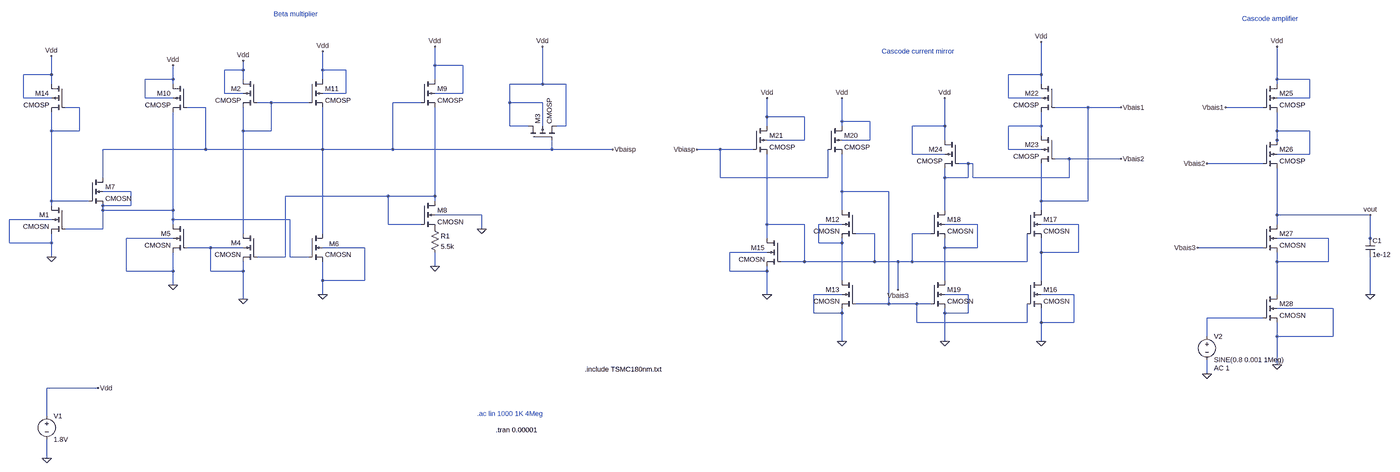
[diagram p0: schematic 180nm_Circuit.asc, whole sheet]
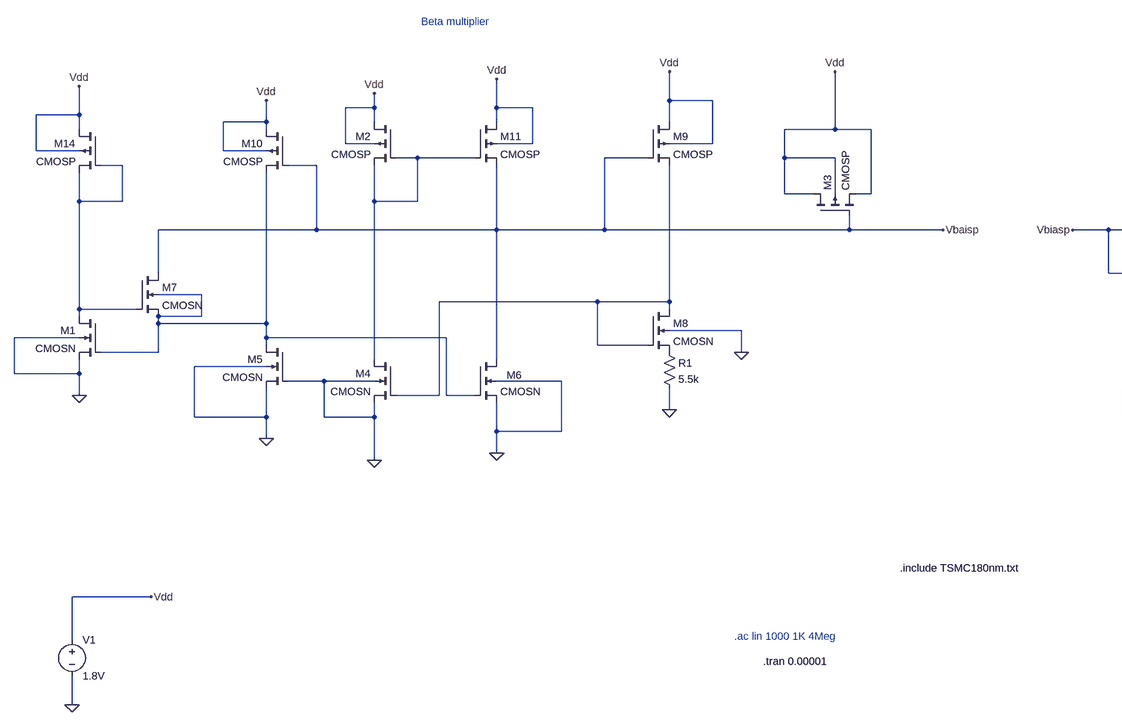
[diagram p1: schematic 180nm_Circuit.asc, part, row 1 of 1, column 1 of 2]
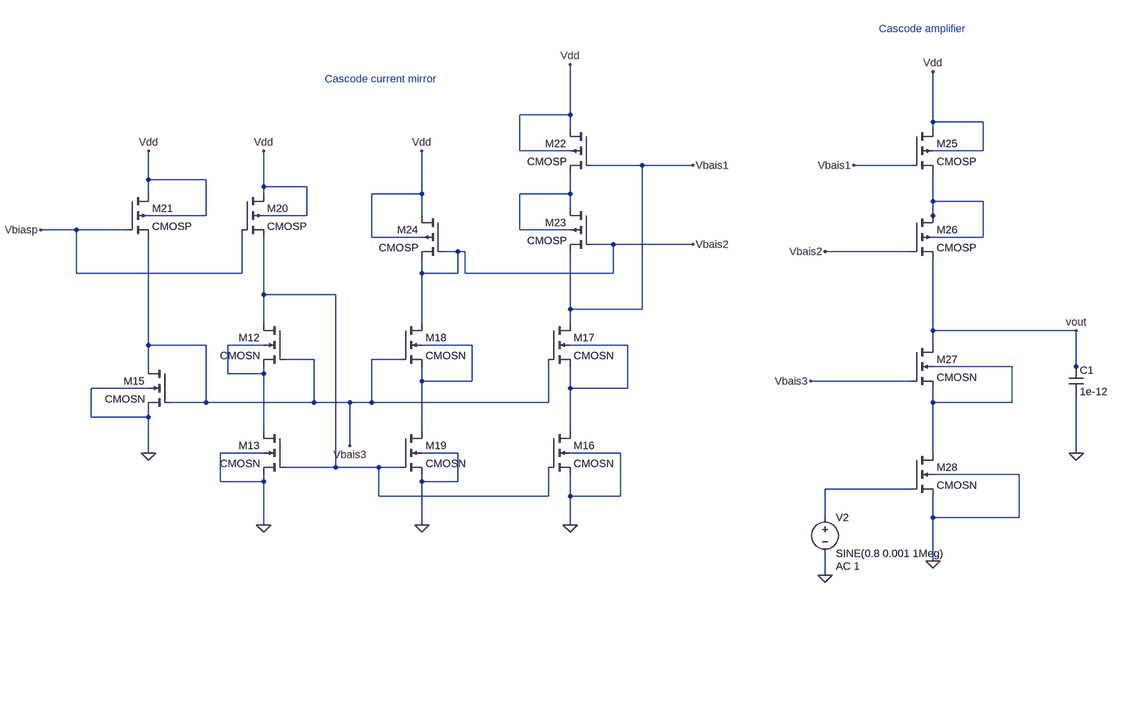
[diagram p2: schematic 180nm_Circuit.asc, part, row 1 of 1, column 2 of 2]
180nm_Circuit.asc, the LTspice schematic file:
Version 4
SHEET 1 6480 1124
WIRE 1392 -416 1392 -480
WIRE 1488 -416 1392 -416
WIRE 736 -400 736 -432
WIRE 736 -400 672 -400
WIRE 1008 -400 1008 -464
WIRE 1088 -400 1008 -400
WIRE 80 -384 80 -448
WIRE 80 -384 -16 -384
WIRE 3504 -384 3504 -496
WIRE 3504 -384 3392 -384
WIRE 496 -368 496 -416
WIRE 496 -368 400 -368
WIRE 736 -368 736 -400
WIRE 1008 -368 1008 -400
WIRE 1392 -368 1392 -416
WIRE 4736 -368 4736 -480
WIRE 4848 -368 4736 -368
WIRE 80 -352 80 -384
WIRE 496 -352 496 -368
WIRE 1760 -352 1760 -480
WIRE 1760 -352 1648 -352
WIRE 1840 -352 1760 -352
WIRE 3504 -352 3504 -384
WIRE 4736 -352 4736 -368
WIRE 672 -320 672 -400
WIRE 736 -320 672 -320
WIRE 1088 -320 1088 -400
WIRE 1088 -320 1008 -320
WIRE 1488 -320 1488 -416
WIRE 1488 -320 1392 -320
WIRE -16 -304 -16 -384
WIRE 80 -304 -16 -304
WIRE 400 -304 400 -368
WIRE 496 -304 400 -304
WIRE 3392 -304 3392 -384
WIRE 3504 -304 3392 -304
WIRE 4848 -304 4848 -368
WIRE 4848 -304 4736 -304
WIRE 832 -288 784 -288
WIRE 960 -288 832 -288
WIRE 1344 -288 1248 -288
WIRE 1648 -288 1648 -352
WIRE 1760 -288 1648 -288
WIRE 176 -272 128 -272
WIRE 608 -272 544 -272
WIRE 3664 -272 3552 -272
WIRE 4064 -272 3664 -272
WIRE 4688 -272 4560 -272
WIRE 2528 -240 2528 -304
WIRE 2656 -240 2528 -240
WIRE 2784 -224 2784 -304
WIRE 2880 -224 2784 -224
WIRE 1648 -208 1648 -288
WIRE 1712 -208 1648 -208
WIRE 1760 -208 1760 -288
WIRE 1840 -208 1840 -352
WIRE 1840 -208 1808 -208
WIRE 2528 -208 2528 -240
WIRE 2784 -208 2784 -224
WIRE 3136 -208 3136 -304
WIRE 3136 -208 3024 -208
WIRE 3504 -208 3504 -256
WIRE 3504 -208 3392 -208
WIRE 80 -192 80 -256
WIRE 176 -192 176 -272
WIRE 176 -192 80 -192
WIRE 736 -192 736 -272
WIRE 832 -192 832 -288
WIRE 832 -192 736 -192
WIRE 4736 -192 4736 -256
WIRE 4848 -192 4736 -192
WIRE 3504 -176 3504 -208
WIRE 2656 -160 2656 -240
WIRE 2656 -160 2528 -160
WIRE 2880 -160 2880 -224
WIRE 2880 -160 2784 -160
WIRE 3136 -160 3136 -208
WIRE 4736 -160 4736 -192
WIRE 4736 -144 4736 -160
WIRE 608 -128 608 -272
WIRE 608 -128 256 -128
WIRE 1008 -128 1008 -272
WIRE 1008 -128 608 -128
WIRE 1248 -128 1248 -288
WIRE 1248 -128 1008 -128
WIRE 1792 -128 1792 -160
WIRE 1792 -128 1248 -128
WIRE 2000 -128 1792 -128
WIRE 2368 -128 2288 -128
WIRE 2480 -128 2368 -128
WIRE 3392 -128 3392 -208
WIRE 3504 -128 3392 -128
WIRE 3024 -112 3024 -208
WIRE 3136 -112 3024 -112
WIRE 4848 -112 4848 -192
WIRE 4848 -112 4736 -112
WIRE 3600 -96 3552 -96
WIRE 4064 -96 3600 -96
WIRE 3216 -80 3184 -80
WIRE 3232 -80 3216 -80
WIRE 4688 -80 4496 -80
WIRE 256 -32 256 -128
WIRE 2368 -32 2368 -128
WIRE 2736 -32 2736 -128
WIRE 2736 -32 2368 -32
WIRE 3136 -32 3136 -64
WIRE 3216 -32 3216 -80
WIRE 3216 -32 3136 -32
WIRE 3232 -32 3232 -80
WIRE 3600 -32 3600 -96
WIRE 3600 -32 3232 -32
WIRE 352 16 256 16
WIRE 2784 16 2784 -112
WIRE 2944 16 2784 16
WIRE 1232 32 880 32
WIRE 1392 32 1392 -272
WIRE 1392 32 1232 32
WIRE 80 48 80 -192
WIRE 208 48 80 48
WIRE 1392 48 1392 32
WIRE 3504 48 3504 -80
WIRE 3664 48 3664 -272
WIRE 3664 48 3504 48
WIRE 80 64 80 48
WIRE 352 64 352 16
WIRE 352 64 256 64
WIRE 256 80 256 64
WIRE 496 80 496 -256
WIRE 496 80 256 80
WIRE 2784 80 2784 16
WIRE 3136 80 3136 -32
WIRE 3504 80 3504 48
WIRE 1552 96 1392 96
WIRE 4736 96 4736 -64
WIRE 5088 96 4736 96
WIRE 80 112 -64 112
WIRE 496 112 496 80
WIRE 896 112 496 112
WIRE 496 128 496 112
WIRE 1232 128 1232 32
WIRE 1344 128 1232 128
WIRE 2528 128 2528 -112
WIRE 2656 128 2528 128
WIRE 2784 128 2704 128
WIRE 3248 128 3136 128
WIRE 3632 128 3504 128
WIRE 4736 128 4736 96
WIRE 256 144 256 80
WIRE 256 144 128 144
WIRE 1552 144 1552 96
WIRE 736 160 736 -192
WIRE 1008 160 1008 -128
WIRE 2896 160 2832 160
WIRE 3088 160 3024 160
WIRE 496 176 336 176
WIRE 2528 176 2528 128
WIRE 4912 176 4736 176
WIRE 5088 176 5088 96
WIRE -64 192 -64 112
WIRE 80 192 80 160
WIRE 80 192 -64 192
WIRE 2704 192 2704 128
WIRE 2784 192 2784 176
WIRE 2784 192 2704 192
WIRE 5088 192 5088 176
WIRE 624 208 544 208
WIRE 736 208 624 208
WIRE 1152 208 1008 208
WIRE 3136 208 3136 176
WIRE 3248 208 3248 128
WIRE 3248 208 3136 208
WIRE 4688 208 4464 208
WIRE 2528 224 2400 224
WIRE 3504 224 3504 176
WIRE 3632 224 3632 128
WIRE 3632 224 3504 224
WIRE 80 240 80 192
WIRE 880 240 880 32
WIRE 880 240 784 240
WIRE 896 240 896 112
WIRE 960 240 896 240
WIRE 2656 256 2656 128
WIRE 2656 256 2576 256
WIRE 2896 256 2896 160
WIRE 2896 256 2656 256
WIRE 2976 256 2896 256
WIRE 3024 256 3024 160
WIRE 3024 256 2976 256
WIRE 3456 256 3456 160
WIRE 3456 256 3024 256
WIRE 4736 256 4736 224
WIRE 4912 256 4912 176
WIRE 4912 256 4736 256
WIRE 1392 272 1392 224
WIRE 336 288 336 176
WIRE 496 288 496 224
WIRE 496 288 336 288
WIRE 624 288 624 208
WIRE 736 288 736 256
WIRE 736 288 624 288
WIRE 2400 288 2400 224
WIRE 2528 288 2528 272
WIRE 2528 288 2400 288
WIRE 1008 320 1008 256
WIRE 1152 320 1152 208
WIRE 1152 320 1008 320
WIRE 2784 320 2784 192
WIRE 3136 320 3136 208
WIRE 3504 320 3504 224
WIRE 496 336 496 288
WIRE 2976 352 2976 256
WIRE 1008 368 1008 320
WIRE 2528 368 2528 288
WIRE 2784 368 2688 368
WIRE 3216 368 3136 368
WIRE 3616 368 3504 368
WIRE 4736 368 4736 256
WIRE 5088 368 5088 240
WIRE 736 384 736 288
WIRE 2944 400 2944 16
WIRE 2944 400 2832 400
WIRE 3040 400 2944 400
WIRE 3088 400 3040 400
WIRE 4928 416 4736 416
WIRE 2688 432 2688 368
WIRE 2784 432 2784 416
WIRE 2784 432 2688 432
WIRE 3136 432 3136 416
WIRE 3216 432 3216 368
WIRE 3216 432 3136 432
WIRE 4688 448 4496 448
WIRE 3040 464 3040 400
WIRE 3456 464 3456 400
WIRE 3456 464 3040 464
WIRE 3504 464 3504 416
WIRE 3616 464 3616 368
WIRE 3616 464 3504 464
WIRE 4496 512 4496 448
WIRE 4736 512 4736 464
WIRE 4928 512 4928 416
WIRE 4928 512 4736 512
WIRE 2784 528 2784 432
WIRE 3136 528 3136 432
WIRE 3504 528 3504 464
WIRE 4736 608 4736 512
WIRE 4496 640 4496 592
WIRE 240 688 64 688
WIRE 64 784 64 688
WIRE 64 928 64 864
FLAG 496 336 0
FLAG 736 384 0
FLAG 1008 368 0
FLAG 80 240 0
FLAG 1392 272 0
FLAG 64 928 0
FLAG 240 688 Vdd
FLAG 80 -448 Vdd
FLAG 496 -416 Vdd
FLAG 736 -432 Vdd
FLAG 1008 -464 Vdd
FLAG 1392 -480 Vdd
FLAG 1760 -480 Vdd
FLAG 2528 368 0
FLAG 2784 528 0
FLAG 3136 528 0
FLAG 3504 528 0
FLAG 2528 -304 Vdd
FLAG 2784 -304 Vdd
FLAG 3136 -304 Vdd
FLAG 3504 -496 Vdd
FLAG 5088 368 0
FLAG 4736 608 0
FLAG 4064 -272 Vbais1
FLAG 4064 -96 Vbais2
FLAG 4560 -272 Vbais1
FLAG 4496 -80 Vbais2
FLAG 4736 -480 Vdd
FLAG 4496 640 0
FLAG 2976 352 Vbais3
FLAG 4464 208 Vbais3
FLAG 2000 -128 Vbaisp
FLAG 2288 -128 Vbiasp
FLAG 1552 144 0
FLAG 5088 96 vout
SYMBOL nmos4 784 160 M0
SYMATTR InstName M4
SYMATTR Value2 l=180nm w=900nm
SYMATTR Value CMOSN
SYMBOL nmos4 544 128 M0
SYMATTR InstName M5
SYMATTR Value2 l=180nm w=900nm
SYMATTR Value CMOSN
SYMBOL nmos4 960 160 R0
WINDOW 0 70 35 Left 2
SYMATTR InstName M6
SYMATTR Value2 l=180nm w=900nm
SYMATTR Value CMOSN
SYMBOL nmos4 208 -32 R0
SYMATTR InstName M7
SYMATTR Value2 l=180nm w=360nm
SYMATTR Value CMOSN
SYMBOL nmos4 1344 48 R0
SYMATTR InstName M8
SYMATTR Value2 l=180nm w=2700nm
SYMATTR Value CMOSN
SYMBOL pmos4 1344 -368 R0
SYMATTR InstName M9
SYMATTR Value2 l=180nm w=2160nm
SYMATTR Value CMOSP
SYMBOL pmos4 544 -352 M0
SYMATTR InstName M10
SYMATTR Value2 l=180nm w=2160nm
SYMATTR Value CMOSP
SYMBOL pmos4 128 -352 M0
SYMATTR InstName M14
SYMATTR Value2 l=360nm w=180nm
SYMATTR Value CMOSP
SYMBOL pmos4 1712 -160 R270
SYMATTR InstName M3
SYMATTR Value2 l=180n w=180n
SYMATTR Value CMOSP
SYMBOL res 1376 128 R0
SYMATTR InstName R1
SYMATTR Value 5.5k
SYMBOL voltage 64 768 R0
WINDOW 123 0 0 Left 0
WINDOW 39 0 0 Left 0
SYMATTR InstName V1
SYMATTR Value 1.8V
SYMBOL nmos4 128 64 M0
SYMATTR InstName M1
SYMATTR Value2 l=180nm w=900nm
SYMATTR Value CMOSN
SYMBOL pmos4 784 -368 M0
SYMATTR InstName M2
SYMATTR Value2 l=180nm w=2160nm
SYMATTR Value CMOSP
SYMBOL pmos4 960 -368 R0
SYMATTR InstName M11
SYMATTR Value2 l=180nm w=2160nm
SYMATTR Value CMOSP
SYMBOL nmos4 2832 80 M0
SYMATTR InstName M12
SYMATTR Value2 l=360nm w=360nm
SYMATTR Value CMOSN
SYMBOL nmos4 2832 320 M0
SYMATTR InstName M13
SYMATTR Value2 l=180nm w=540nm
SYMATTR Value CMOSN
SYMBOL nmos4 2576 176 M0
SYMATTR InstName M15
SYMATTR Value2 l=360nm w=360nm
SYMATTR Value CMOSN
SYMBOL nmos4 3456 320 R0
SYMATTR InstName M16
SYMATTR Value2 l=360nm w=360nm
SYMATTR Value CMOSN
SYMBOL nmos4 3456 80 R0
SYMATTR InstName M17
SYMATTR Value2 l=180nm w=360nm
SYMATTR Value CMOSN
SYMBOL nmos4 3088 80 R0
SYMATTR InstName M18
SYMATTR Value2 l=360nm w=360nm
SYMATTR Value CMOSN
SYMBOL nmos4 3088 320 R0
SYMATTR InstName M19
SYMATTR Value2 l=360nm w=360nm
SYMATTR Value CMOSN
SYMBOL pmos4 2736 -208 R0
SYMATTR InstName M20
SYMATTR Value2 l=180nm w=2700nm
SYMATTR Value CMOSP
SYMBOL pmos4 2480 -208 R0
SYMATTR InstName M21
SYMATTR Value2 l=180nm w=2700nm
SYMATTR Value CMOSP
SYMBOL pmos4 3552 -352 M0
SYMATTR InstName M22
SYMATTR Value2 l=180nm w=2700nm
SYMATTR Value CMOSP
SYMBOL pmos4 3552 -176 M0
SYMATTR InstName M23
SYMATTR Value2 l=180nm w=2700nm
SYMATTR Value CMOSP
SYMBOL pmos4 3184 -160 M0
SYMATTR InstName M24
SYMATTR Value2 l=360nm w=2160nm
SYMATTR Value CMOSP
SYMBOL pmos4 4688 -352 R0
SYMATTR InstName M25
SYMATTR Value2 l=180nm w=2160nm
SYMATTR Value CMOSP
SYMBOL pmos4 4688 -160 R0
SYMATTR InstName M26
SYMATTR Value2 l=180nm w=2160nm
SYMATTR Value CMOSP
SYMBOL nmos4 4688 128 R0
SYMATTR InstName M27
SYMATTR Value2 l=180nm w=900nm
SYMATTR Value CMOSN
SYMBOL nmos4 4688 368 R0
SYMATTR InstName M28
SYMATTR Value2 l=180nm w=900nm
SYMATTR Value CMOSN
SYMBOL cap 5072 176 R0
SYMATTR InstName C1
SYMATTR Value 1e-12
SYMBOL voltage 4496 496 R0
WINDOW 123 24 124 Left 2
WINDOW 39 0 0 Left 0
SYMATTR Value2 AC 1
SYMATTR InstName V2
SYMATTR Value SINE(0.8 0.001 1Meg)
TEXT 1904 624 Left 2 !.include TSMC180nm.txt
TEXT 1536 776 Left 2 ;.ac lin 1000 1K 4Meg
TEXT 840 -592 Left 2 ;Beta multiplier
TEXT 2920 -464 Left 2 ;Cascode current mirror
TEXT 4616 -576 Left 2 ;Cascode amplifier
TEXT 1600 832 Left 2 !.tran 0.00001

The netlist it stands for:
* 180nm_Circuit.asc
M4 N001 N007 0 0 CMOSN l=180nm w=900nm
M5 N005 0 0 0 CMOSN l=180nm w=900nm
M6 Vbaisp N005 0 0 CMOSN l=180nm w=900nm
M7 Vbaisp N002 N005 N005 CMOSN l=180nm w=360nm
M8 N007 N007 P001 0 CMOSN l=180nm w=2700nm
M9 Vdd Vbaisp N007 Vdd CMOSP l=180nm w=2160nm
M10 Vdd Vbaisp N005 Vdd CMOSP l=180nm w=2160nm
M14 Vdd N002 N002 Vdd CMOSP l=360nm w=180nm
M3 Vdd Vbaisp Vdd Vdd CMOSP l=180n w=180n
R1 P001 0 5.5k
V1 Vdd 0 1.8V
M1 N002 N005 0 0 CMOSN l=180nm w=900nm
M2 Vdd N001 N001 Vdd CMOSP l=180nm w=2160nm
M11 Vdd N001 Vbaisp Vdd CMOSP l=180nm w=2160nm
M12 N006 Vbais3 N008 N008 CMOSN l=360nm w=360nm
M13 N008 N006 0 0 CMOSN l=180nm w=540nm
M15 Vbais3 Vbais3 0 0 CMOSN l=360nm w=360nm
M16 N010 N006 0 0 CMOSN l=360nm w=360nm
M17 Vbais1 Vbais3 N010 N010 CMOSN l=180nm w=360nm
M18 Vbais2 Vbais3 N009 N009 CMOSN l=360nm w=360nm
M19 N009 N006 0 0 CMOSN l=360nm w=360nm
M20 Vdd Vbiasp N006 Vdd CMOSP l=180nm w=2700nm
M21 Vdd Vbiasp Vbais3 Vdd CMOSP l=180nm w=2700nm
M22 Vdd Vbais1 N003 Vdd CMOSP l=180nm w=2700nm
M23 N003 Vbais2 Vbais1 N003 CMOSP l=180nm w=2700nm
M24 Vdd Vbais2 Vbais2 Vdd CMOSP l=360nm w=2160nm
M25 Vdd Vbais1 N004 Vdd CMOSP l=180nm w=2160nm
M26 N004 Vbais2 vout N004 CMOSP l=180nm w=2160nm
M27 vout Vbais3 N011 N011 CMOSN l=180nm w=900nm
M28 N011 N012 0 0 CMOSN l=180nm w=900nm
C1 vout 0 1e-12
V2 N012 0 SINE(0.8 0.001 1Meg) AC 1
.model NMOS NMOS
.model PMOS PMOS
.lib standard.mos
.include TSMC180nm.txt
* .ac lin 1000 1K 4Meg
* Beta multiplier
* Cascode current mirror
* Cascode amplifier
.tran 0.00001
.backanno
.end